# Altium schematic sheet 摄像头.SchDoc: 摄像头
size A4; Organization: Altium Limited; Address1: L3, 12a Rodborough Rd; Address2: Frenchs Forest; Address3: NSW; Address4: Australia 2086; DocumentNumber: 1; Revision: V1.0; SheetNumber: 1; SheetTotal: 1; Designer: 樊浩柏
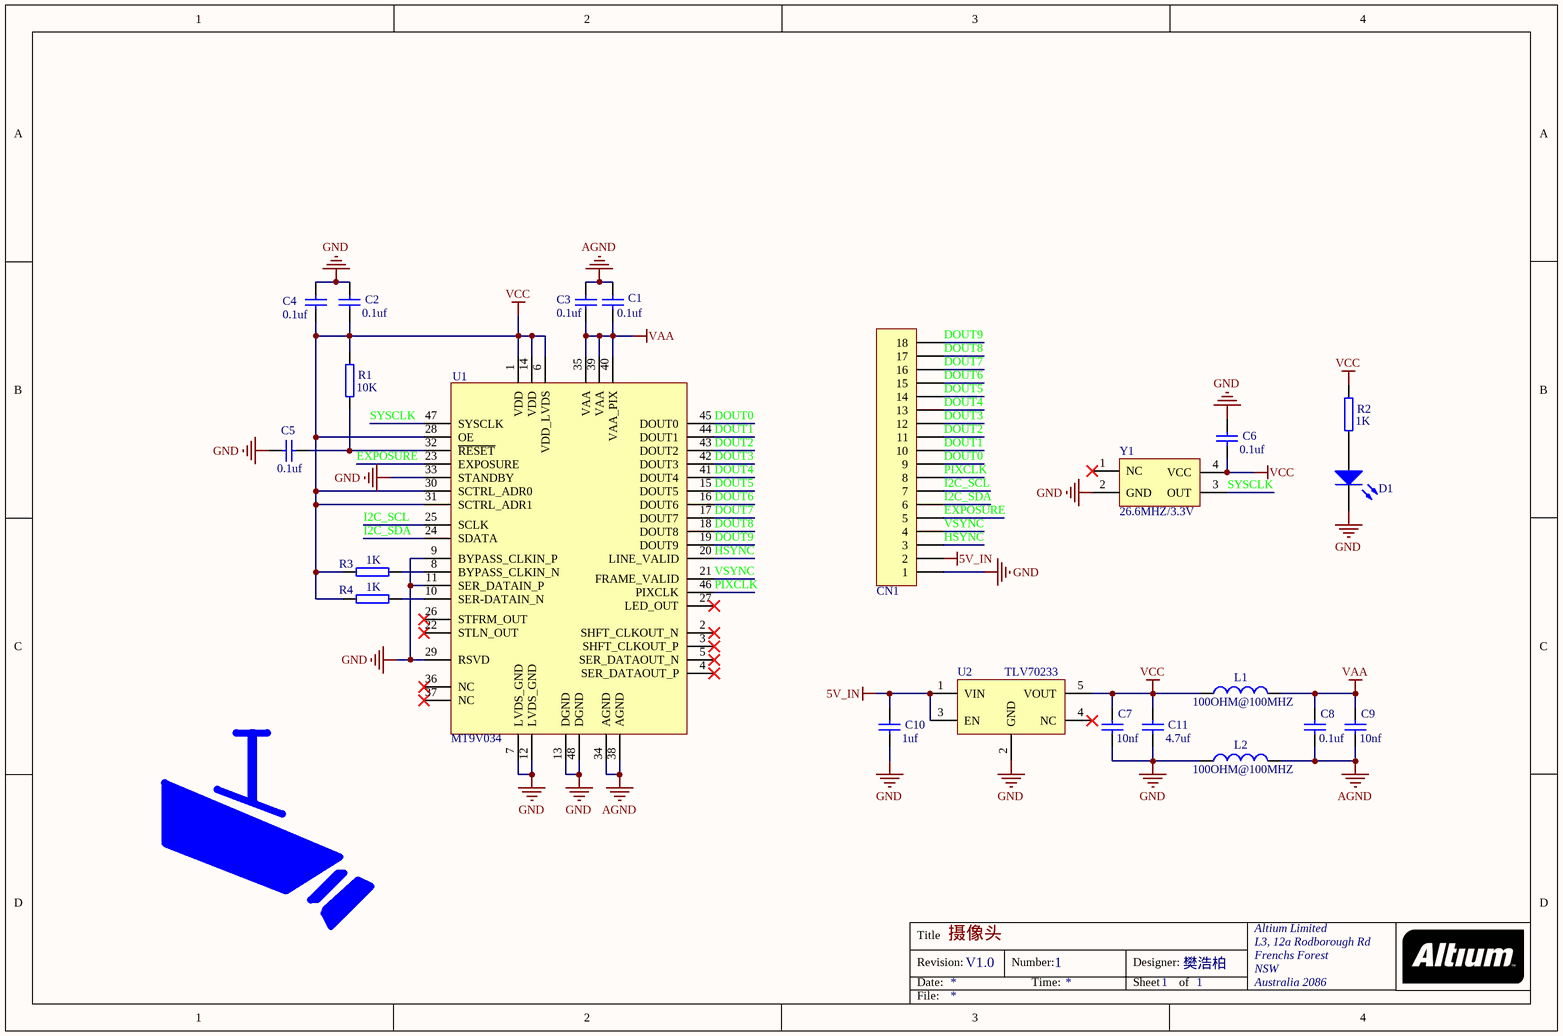
[diagram p0: 摄像头.SchDoc]

## Parts
C1  0.1uf  [CAP-0402]
C2  0.1uf  [CAP-0402]
C3  0.1uf  [CAP-0402]
C4  0.1uf  [CAP-0402]
C5  0.1uf  [CAP-0402]
C6  0.1uf  [CAP-0402]
C7  10nf  [CAP-0402]
C8  0.1uf  [CAP-0402]
C9  10nf  [CAP-0402]
C10  1uf  [CAP-0402]
C11  4.7uf  [CAP-0402]
Camera  Camera  [Camera]  (value not drawn)
CN1  CON-18X1  [HEADER-FPC-ZIF-SMD-Horizontal-0.5-18]  (value not drawn)
D1  LED  [LED-BLU-0603]  (value not drawn)
L1  100OHM@100MHZ  [Chip Inductor-0402_100505]
L2  100OHM@100MHZ  [Chip Inductor-0402_100505]
R1  10K  [RES-0402]
R2  1K  [RES-0402]
R3  1K  [RES-0402]
R4  1K  [RES-0402]
U1  MT9V034  [CLCC-48-11.43X11.43]
U2  TLV70233  [SOT-23-5]
Y1  26.6MHZ/3.3V  [XTAL-OSC-3225]

## Nets
5V_IN: C10.1 CN1.2 U2.1(VIN) U2.3(EN)
AGND: C1.1 C3.2 C8.2 C9.2 L2.2 U1.34(AGND) U1.38(AGND)
GND: C2.1 C4.1 C5.1 C6.1 C7.2 C10.2 C11.2 CN1.1 D1.K L2.1 U1.7(LVDS_GND) U1.9(BYPASS_CLKIN_P) U1.11(SER_DATAIN_P) U1.12(LVDS_GND) U1.13(DGND) U1.29(RSVD) U1.33(STANDBY) U1.48(DGND) U2.2(GND) Y1.2(GND)
VAA: C1.2 C3.1 C8.1 C9.1 L1.2 U1.35(VAA) U1.39(VAA) U1.40(VAA_PIX)
VCC: C2.2 C4.2 C6.2 C7.1 C11.1 L1.1 R1.2 R2.2 R3.1 R4.1 U1.1(VDD) U1.6(VDD_LVDS) U1.14(VDD) U1.28(OE) U1.30(SCTRL_ADR0) U1.31(SCTRL_ADR1) U2.5(VOUT) Y1.4(VCC)
DOUT0: CN1.9 U1.45(DOUT0)
DOUT1: CN1.10 U1.44(DOUT1)
DOUT2: CN1.11 U1.43(DOUT2)
DOUT3: CN1.12 U1.42(DOUT3)
DOUT4: CN1.13 U1.41(DOUT4)
DOUT5: CN1.14 U1.15(DOUT5)
DOUT6: CN1.15 U1.16(DOUT6)
DOUT7: CN1.16 U1.17(DOUT7)
DOUT8: CN1.17 U1.18(DOUT8)
DOUT9: CN1.18 U1.19(DOUT9)
EXPOSURE: CN1.5 U1.23(EXPOSURE)
HSYNC: CN1.3 U1.20(LINE_VALID)
I2C_SCL: CN1.7 U1.25(SCLK)
I2C_SDA: CN1.6 U1.24(SDATA)
PIXCLK: CN1.8 U1.46(PIXCLK)
SYSCLK: U1.47(SYSCLK) Y1.3(OUT)
VSYNC: CN1.4 U1.21(FRAME_VALID)
NetC5_2: C5.2 R1.1 U1.32(~{RESET})
NetD1_A: D1.A R2.1
NetR3_2: R3.2 U1.8(BYPASS_CLKIN_N)
NetR4_2: R4.2 U1.10(SER-DATAIN_N)

Not connected (* = marked no-connect by the designer): U1 2(SHFT_CLKOUT_N)* 3(SHFT_CLKOUT_P)* 4(SER_DATAOUT_P)* 5(SER_DATAOUT_N)* 22(STLN_OUT)* 26(STFRM_OUT)* 27(LED_OUT)* 36(NC)* 37(NC)*; U2 4(NC)*; Y1 1(NC)*

## Notes on the sheet
- Title
- Revision:
- Date:
- Number:
- Time:
- Designer:
- Sheet
- of
- File:

## Library data of the parts
C1-C11 = Cap
L1 L2 = Inductor
R1-R4 = Res
U2 = LDO: Published: 24-Mar-1999; LatestRevisionDate: 29-May-2009; LatestRevisionNote: IPC-7351 Footprint Added.; PackageReference: D2PAK; Publisher: Altium Limited; PackageDescription: 3-Pin Transistor Outline Package 2.54 mm Pitch, 15.1 mm Lead Span
Y1 = XTAL-OSC